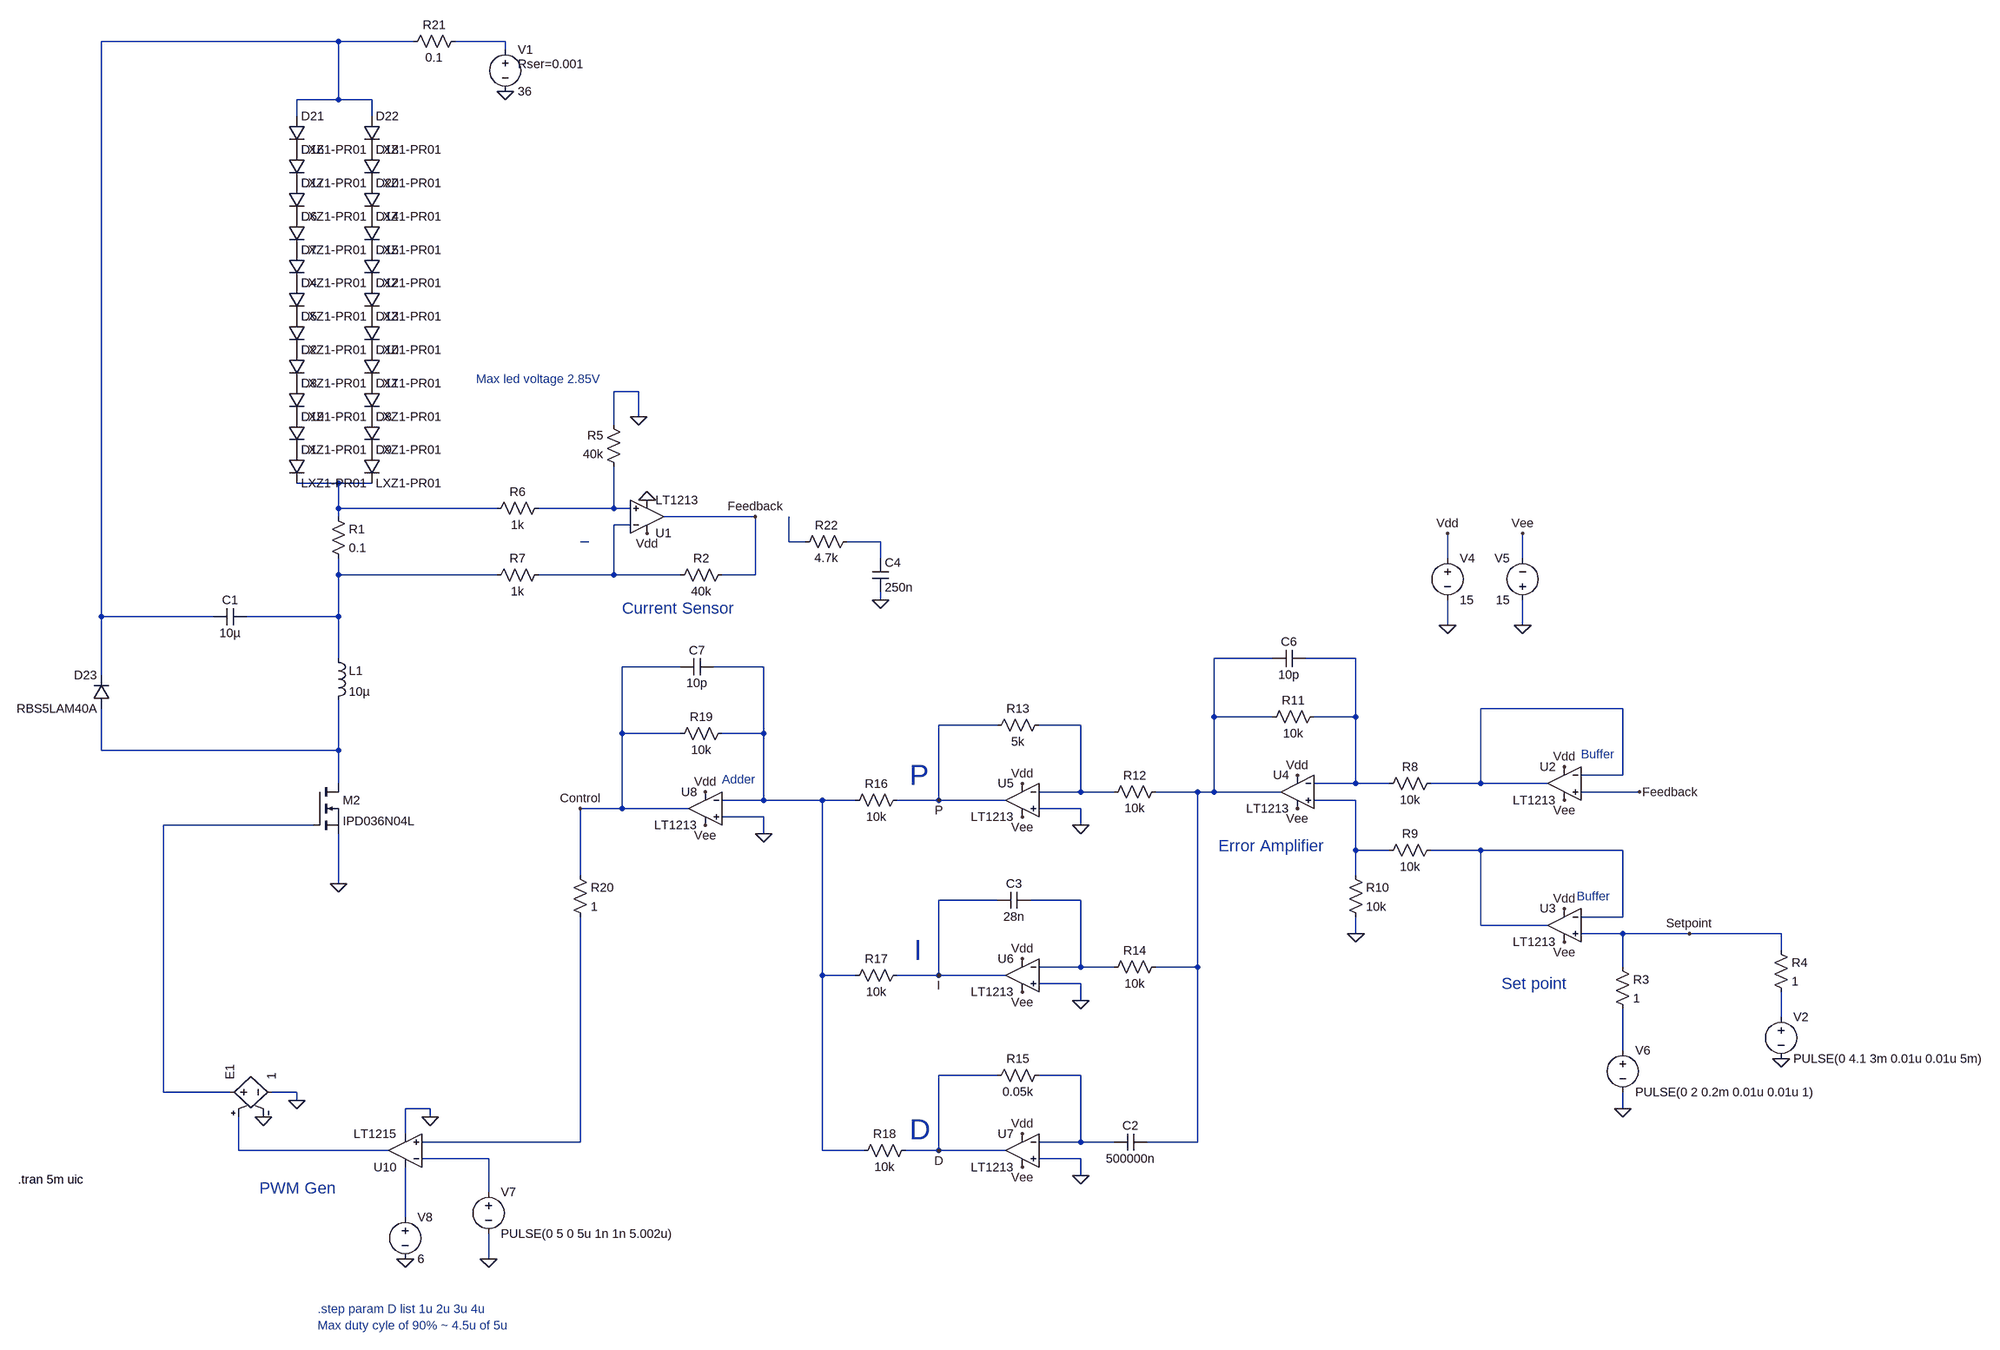
[diagram p0: schematic BuckConvertorTests.asc]
BuckConvertorTests.asc, the LTspice schematic file:
Version 4.1
SHEET 1 3436 2468
WIRE 256 -176 -224 -176
WIRE 400 -176 256 -176
WIRE 576 -176 480 -176
WIRE 576 -160 576 -176
WIRE 256 -64 256 -176
WIRE 256 -64 176 -64
WIRE 320 -64 256 -64
WIRE 176 -32 176 -64
WIRE 320 -32 320 -64
WIRE 832 496 784 496
WIRE 832 544 832 496
WIRE 784 560 784 496
WIRE 256 672 176 672
WIRE 320 672 256 672
WIRE 256 720 256 672
WIRE 560 720 256 720
WIRE 784 720 784 640
WIRE 784 720 640 720
WIRE 816 720 784 720
WIRE 256 736 256 720
WIRE 1056 736 880 736
WIRE 816 752 784 752
WIRE 736 784 720 784
WIRE 1120 784 1120 736
WIRE 1152 784 1120 784
WIRE 1296 784 1232 784
WIRE 1296 816 1296 784
WIRE 2384 816 2384 768
WIRE 2528 816 2528 768
WIRE 256 848 256 816
WIRE 560 848 256 848
WIRE 784 848 784 752
WIRE 784 848 640 848
WIRE 912 848 784 848
WIRE 1056 848 1056 736
WIRE 1056 848 992 848
WIRE 1296 896 1296 880
WIRE -224 928 -224 -176
WIRE 16 928 -224 928
WIRE 256 928 256 848
WIRE 256 928 80 928
WIRE 2384 944 2384 896
WIRE 2528 944 2528 896
WIRE 256 1008 256 928
WIRE 2048 1008 1936 1008
WIRE 2208 1008 2112 1008
WIRE 912 1024 800 1024
WIRE 1072 1024 976 1024
WIRE -224 1040 -224 928
WIRE 2720 1104 2448 1104
WIRE 1936 1120 1936 1008
WIRE 2048 1120 1936 1120
WIRE 2208 1120 2208 1008
WIRE 2208 1120 2128 1120
WIRE 1520 1136 1408 1136
WIRE 1680 1136 1600 1136
WIRE 800 1152 800 1024
WIRE 912 1152 800 1152
WIRE 1072 1152 1072 1024
WIRE 1072 1152 992 1152
WIRE -224 1184 -224 1104
WIRE 256 1184 256 1088
WIRE 256 1184 -224 1184
WIRE 2720 1232 2720 1104
WIRE 2720 1232 2640 1232
WIRE 256 1248 256 1184
WIRE 2208 1248 2208 1120
WIRE 2208 1248 2128 1248
WIRE 2272 1248 2208 1248
WIRE 2448 1248 2448 1104
WIRE 2448 1248 2352 1248
WIRE 2576 1248 2448 1248
WIRE 1680 1264 1680 1136
WIRE 1680 1264 1600 1264
WIRE 1744 1264 1680 1264
WIRE 1904 1264 1824 1264
WIRE 1936 1264 1936 1120
WIRE 1936 1264 1904 1264
WIRE 2064 1264 1936 1264
WIRE 2752 1264 2640 1264
WIRE 1072 1280 1072 1152
WIRE 1072 1280 992 1280
WIRE 1184 1280 1072 1280
WIRE 1248 1280 1184 1280
WIRE 1408 1280 1408 1136
WIRE 1408 1280 1328 1280
WIRE 1536 1280 1408 1280
WIRE 2208 1280 2128 1280
WIRE 800 1296 800 1152
WIRE 800 1296 720 1296
WIRE 928 1296 800 1296
WIRE 1680 1296 1600 1296
WIRE 1072 1312 992 1312
WIRE 208 1328 -80 1328
WIRE 1680 1328 1680 1296
WIRE 1072 1344 1072 1312
WIRE 2208 1376 2208 1280
WIRE 2272 1376 2208 1376
WIRE 2448 1376 2352 1376
WIRE 2720 1376 2448 1376
WIRE 720 1424 720 1296
WIRE 2208 1424 2208 1376
WIRE 256 1440 256 1344
WIRE 1520 1472 1408 1472
WIRE 1680 1472 1584 1472
WIRE 2720 1504 2720 1376
WIRE 2720 1504 2640 1504
WIRE 2448 1520 2448 1376
WIRE 2576 1520 2448 1520
WIRE 2208 1536 2208 1504
WIRE 2720 1536 2640 1536
WIRE 2848 1536 2720 1536
WIRE 3024 1536 2848 1536
WIRE 3024 1568 3024 1536
WIRE 1680 1600 1680 1472
WIRE 1680 1600 1600 1600
WIRE 1744 1600 1680 1600
WIRE 1904 1600 1904 1264
WIRE 1904 1600 1824 1600
WIRE 2720 1600 2720 1536
WIRE 1184 1616 1184 1280
WIRE 1248 1616 1184 1616
WIRE 1408 1616 1408 1472
WIRE 1408 1616 1328 1616
WIRE 1536 1616 1408 1616
WIRE 1680 1632 1600 1632
WIRE 1680 1664 1680 1632
WIRE 3024 1696 3024 1648
WIRE 2720 1760 2720 1680
WIRE 1520 1808 1408 1808
WIRE 1680 1808 1600 1808
WIRE -80 1840 -80 1328
WIRE 48 1840 -80 1840
WIRE 176 1840 128 1840
WIRE 176 1856 176 1840
WIRE 432 1872 384 1872
WIRE 2720 1872 2720 1840
WIRE 432 1888 432 1872
WIRE 384 1920 384 1872
WIRE 720 1936 720 1504
WIRE 720 1936 416 1936
WIRE 1680 1936 1680 1808
WIRE 1680 1936 1600 1936
WIRE 1744 1936 1680 1936
WIRE 1904 1936 1904 1600
WIRE 1904 1936 1808 1936
WIRE 64 1952 64 1888
WIRE 352 1952 64 1952
WIRE 1184 1952 1184 1616
WIRE 1264 1952 1184 1952
WIRE 1408 1952 1408 1808
WIRE 1408 1952 1344 1952
WIRE 1536 1952 1408 1952
WIRE 544 1968 416 1968
WIRE 1680 1968 1600 1968
WIRE 1680 2000 1680 1968
WIRE 544 2032 544 1968
WIRE 384 2080 384 1984
WIRE 544 2160 544 2112
FLAG 256 1440 0
FLAG 2384 944 0
FLAG 2528 944 0
FLAG 2384 768 Vdd
FLAG 2528 768 Vee
FLAG 848 768 Vdd
FLAG 832 544 0
FLAG 2752 1264 Feedback
FLAG 2608 1216 Vdd
FLAG 2608 1488 Vdd
FLAG 2608 1280 Vee
FLAG 2608 1552 Vee
FLAG 2720 1872 0
FLAG 2096 1232 Vdd
FLAG 2096 1296 Vee
FLAG 2208 1536 0
FLAG 1568 1248 Vdd
FLAG 1568 1312 Vee
FLAG 1568 1584 Vdd
FLAG 1568 1648 Vee
FLAG 1568 1920 Vdd
FLAG 1568 1984 Vee
FLAG 1680 1328 0
FLAG 1680 1664 0
FLAG 1680 2000 0
FLAG 960 1264 Vdd
FLAG 960 1328 Vee
FLAG 1072 1344 0
FLAG 720 1296 Control
FLAG 544 2160 0
FLAG 432 1888 0
FLAG 112 1888 0
FLAG 176 1856 0
FLAG 384 2160 0
FLAG 848 704 0
FLAG 1408 1280 P
FLAG 1408 1616 I
FLAG 576 -80 0
FLAG 3024 1776 0
FLAG 2848 1536 Setpoint
FLAG 1408 1952 D
FLAG 1296 896 0
FLAG 1056 736 Feedback
SYMBOL voltage 576 -176 R0
WINDOW 123 0 0 Left 0
WINDOW 39 24 44 Left 2
SYMATTR SpiceLine Rser=0.001
SYMATTR InstName V1
SYMATTR Value 36
SYMBOL diode 160 544 R0
SYMATTR InstName D19
SYMATTR Value LXZ1-PR01
SYMBOL diode 160 608 R0
SYMATTR InstName D1
SYMATTR Value LXZ1-PR01
SYMBOL diode 160 416 R0
SYMATTR InstName D2
SYMATTR Value LXZ1-PR01
SYMBOL diode 160 480 R0
SYMATTR InstName D3
SYMATTR Value LXZ1-PR01
SYMBOL diode 160 288 R0
SYMATTR InstName D4
SYMATTR Value LXZ1-PR01
SYMBOL diode 160 352 R0
SYMATTR InstName D5
SYMATTR Value LXZ1-PR01
SYMBOL diode 160 160 R0
SYMATTR InstName D6
SYMATTR Value LXZ1-PR01
SYMBOL diode 160 224 R0
SYMATTR InstName D7
SYMATTR Value LXZ1-PR01
SYMBOL diode 304 544 R0
SYMATTR InstName D8
SYMATTR Value LXZ1-PR01
SYMBOL diode 304 608 R0
SYMATTR InstName D9
SYMATTR Value LXZ1-PR01
SYMBOL diode 304 416 R0
SYMATTR InstName D10
SYMATTR Value LXZ1-PR01
SYMBOL diode 304 480 R0
SYMATTR InstName D11
SYMATTR Value LXZ1-PR01
SYMBOL diode 304 288 R0
SYMATTR InstName D12
SYMATTR Value LXZ1-PR01
SYMBOL diode 304 352 R0
SYMATTR InstName D13
SYMATTR Value LXZ1-PR01
SYMBOL diode 304 160 R0
SYMATTR InstName D14
SYMATTR Value LXZ1-PR01
SYMBOL diode 304 224 R0
SYMATTR InstName D15
SYMATTR Value LXZ1-PR01
SYMBOL diode 160 32 R0
SYMATTR InstName D16
SYMATTR Value LXZ1-PR01
SYMBOL diode 160 96 R0
SYMATTR InstName D17
SYMATTR Value LXZ1-PR01
SYMBOL diode 304 32 R0
SYMATTR InstName D18
SYMATTR Value LXZ1-PR01
SYMBOL diode 304 96 R0
SYMATTR InstName D20
SYMATTR Value LXZ1-PR01
SYMBOL diode 160 -32 R0
SYMATTR InstName D21
SYMATTR Value LXZ1-PR01
SYMBOL diode 304 -32 R0
SYMATTR InstName D22
SYMATTR Value LXZ1-PR01
SYMBOL res 240 720 R0
SYMATTR InstName R1
SYMATTR Value 0.1
SYMBOL nmos 208 1248 R0
SYMATTR InstName M2
SYMATTR Value IPD036N04L
SYMBOL cap 16 944 R270
WINDOW 0 32 32 VTop 2
WINDOW 3 0 32 VBottom 2
SYMATTR InstName C1
SYMATTR Value 10µ
SYMBOL diode -208 1104 R180
WINDOW 0 24 64 Left 2
WINDOW 3 24 0 Left 2
SYMATTR InstName D23
SYMATTR Value RBS5LAM40A
SYMBOL ind 240 992 R0
SYMATTR InstName L1
SYMATTR Value 10µ
SYMATTR SpiceLine Rser=1m
SYMBOL OpAmps\\LT1213 848 800 M180
SYMATTR InstName U1
SYMBOL voltage 2384 800 R0
WINDOW 123 0 0 Left 0
WINDOW 39 0 0 Left 0
SYMATTR InstName V4
SYMATTR Value 15
SYMBOL voltage 2528 912 R180
WINDOW 0 24 96 Left 2
WINDOW 3 24 16 Left 2
WINDOW 123 0 0 Left 0
WINDOW 39 0 0 Left 0
SYMATTR InstName V5
SYMATTR Value 15
SYMBOL res 1008 832 R90
WINDOW 0 0 56 VBottom 2
WINDOW 3 32 56 VTop 2
SYMATTR InstName R2
SYMATTR Value 40k
SYMBOL res 800 656 R180
WINDOW 0 36 76 Left 2
WINDOW 3 36 40 Left 2
SYMATTR InstName R5
SYMATTR Value 40k
SYMBOL res 656 704 R90
WINDOW 0 0 56 VBottom 2
WINDOW 3 32 56 VTop 2
SYMATTR InstName R6
SYMATTR Value 1k
SYMBOL res 656 832 R90
WINDOW 0 0 56 VBottom 2
WINDOW 3 32 56 VTop 2
SYMATTR InstName R7
SYMATTR Value 1k
SYMBOL OpAmps\\LT1213 2608 1184 M0
SYMATTR InstName U2
SYMBOL voltage 2720 1744 R0
WINDOW 123 0 0 Left 0
WINDOW 39 0 0 Left 0
SYMATTR InstName V6
SYMATTR Value PULSE(0 2 0.2m 0.01u 0.01u 1)
SYMBOL res 2368 1232 R90
WINDOW 0 0 56 VBottom 2
WINDOW 3 32 56 VTop 2
SYMATTR InstName R8
SYMATTR Value 10k
SYMBOL res 2368 1360 R90
WINDOW 0 0 56 VBottom 2
WINDOW 3 32 56 VTop 2
SYMATTR InstName R9
SYMATTR Value 10k
SYMBOL res 2192 1408 R0
SYMATTR InstName R10
SYMATTR Value 10k
SYMBOL res 2144 1104 R90
WINDOW 0 0 56 VBottom 2
WINDOW 3 32 56 VTop 2
SYMATTR InstName R11
SYMATTR Value 10k
SYMBOL res 1840 1248 R90
WINDOW 0 0 56 VBottom 2
WINDOW 3 32 56 VTop 2
SYMATTR InstName R12
SYMATTR Value 10k
SYMBOL res 1616 1120 R90
WINDOW 0 0 56 VBottom 2
WINDOW 3 32 56 VTop 2
SYMATTR InstName R13
SYMATTR Value 5k
SYMBOL res 1840 1584 R90
WINDOW 0 0 56 VBottom 2
WINDOW 3 32 56 VTop 2
SYMATTR InstName R14
SYMATTR Value 10k
SYMBOL res 1616 1792 R90
WINDOW 0 0 56 VBottom 2
WINDOW 3 32 56 VTop 2
SYMATTR InstName R15
SYMATTR Value 0.05k
SYMBOL cap 1808 1920 R90
WINDOW 0 0 32 VBottom 2
WINDOW 3 32 32 VTop 2
SYMATTR InstName C2
SYMATTR Value 500000n
SYMBOL cap 1584 1456 R90
WINDOW 0 0 32 VBottom 2
WINDOW 3 32 32 VTop 2
SYMATTR InstName C3
SYMATTR Value 28n
SYMBOL res 1344 1264 R90
WINDOW 0 0 56 VBottom 2
WINDOW 3 32 56 VTop 2
SYMATTR InstName R16
SYMATTR Value 10k
SYMBOL res 1344 1600 R90
WINDOW 0 0 56 VBottom 2
WINDOW 3 32 56 VTop 2
SYMATTR InstName R17
SYMATTR Value 10k
SYMBOL res 1360 1936 R90
WINDOW 0 0 56 VBottom 2
WINDOW 3 32 56 VTop 2
SYMATTR InstName R18
SYMATTR Value 10k
SYMBOL res 1008 1136 R90
WINDOW 0 0 56 VBottom 2
WINDOW 3 32 56 VTop 2
SYMATTR InstName R19
SYMATTR Value 10k
SYMBOL OpAmps\\LT1213 2608 1456 M0
SYMATTR InstName U3
SYMBOL OpAmps\\LT1213 2096 1200 M0
SYMATTR InstName U4
SYMBOL OpAmps\\LT1213 1568 1216 M0
SYMATTR InstName U5
SYMBOL OpAmps\\LT1213 1568 1552 M0
SYMATTR InstName U6
SYMBOL OpAmps\\LT1213 1568 1888 M0
SYMATTR InstName U7
SYMBOL OpAmps\\LT1213 960 1232 M0
SYMATTR InstName U8
SYMBOL voltage 544 2016 R0
WINDOW 123 0 0 Left 0
WINDOW 39 0 0 Left 0
SYMATTR InstName V7
SYMATTR Value PULSE(0 5 0 5u 1n 1n 5.002u)
SYMBOL res 704 1408 R0
SYMATTR InstName R20
SYMATTR Value 1
SYMBOL e 32 1840 R270
SYMATTR InstName E1
SYMATTR Value 1
SYMBOL OpAmps\\LT1215 384 2016 R180
SYMATTR InstName U10
SYMBOL voltage 384 2064 R0
WINDOW 123 0 0 Left 0
WINDOW 39 0 0 Left 0
SYMATTR InstName V8
SYMATTR Value 6
SYMBOL voltage 3024 1680 R0
WINDOW 123 0 0 Left 0
WINDOW 39 0 0 Left 0
SYMATTR InstName V2
SYMATTR Value PULSE(0 4.1 3m 0.01u 0.01u 5m)
SYMBOL res 2704 1584 R0
SYMATTR InstName R3
SYMATTR Value 1
SYMBOL res 3008 1552 R0
SYMATTR InstName R4
SYMATTR Value 1
SYMBOL res 496 -192 R90
WINDOW 0 0 56 VBottom 2
WINDOW 3 32 56 VTop 2
SYMATTR InstName R21
SYMATTR Value 0.1
SYMBOL cap 1280 816 R0
SYMATTR InstName C4
SYMATTR Value 250n
SYMBOL res 1248 768 R90
WINDOW 0 0 56 VBottom 2
WINDOW 3 32 56 VTop 2
SYMATTR InstName R22
SYMATTR Value 4.7k
SYMBOL cap 2112 992 R90
WINDOW 0 0 32 VBottom 2
WINDOW 3 32 32 VTop 2
SYMATTR InstName C6
SYMATTR Value 10p
SYMBOL cap 976 1008 R90
WINDOW 0 0 32 VBottom 2
WINDOW 3 32 32 VTop 2
SYMATTR InstName C7
SYMATTR Value 10p
TEXT -384 2008 Left 2 !.tran 5m uic
TEXT 520 472 Left 2 ;Max led voltage 2.85V
TEXT 216 2256 Left 2 ;.step param D list 1u 2u 3u 4u
TEXT 216 2288 Left 2 ;Max duty cyle of 90% ~ 4.5u of 5u
TEXT 1944 1368 Left 3 ;Error Amplifier
TEXT 1352 1232 Left 5 ;P
TEXT 1360 1568 Left 5 ;I
TEXT 1352 1912 Left 5 ;D
TEXT 2488 1632 Left 3 ;Set point
TEXT 2640 1192 Left 2 ;Buffer
TEXT 2632 1464 Left 2 ;Buffer
TEXT 104 2024 Left 3 ;PWM Gen
TEXT 992 1240 Left 2 ;Adder
TEXT 800 912 Left 3 ;Current Sensor

The netlist it stands for:
* BuckConvertorTests.asc
V1 N002 0 36 Rser=0.001
D19 P001 P002 LXZ1-PR01
D1 P002 N003 LXZ1-PR01
D2 P003 P004 LXZ1-PR01
D3 P004 P001 LXZ1-PR01
D4 P005 P006 LXZ1-PR01
D5 P006 P003 LXZ1-PR01
D6 P007 P008 LXZ1-PR01
D7 P008 P005 LXZ1-PR01
D8 P009 P010 LXZ1-PR01
D9 P010 N003 LXZ1-PR01
D10 P011 P012 LXZ1-PR01
D11 P012 P009 LXZ1-PR01
D12 P013 P014 LXZ1-PR01
D13 P014 P011 LXZ1-PR01
D14 P015 P016 LXZ1-PR01
D15 P016 P013 LXZ1-PR01
D16 P017 P018 LXZ1-PR01
D17 P018 P007 LXZ1-PR01
D18 P019 P020 LXZ1-PR01
D20 P020 P015 LXZ1-PR01
D21 N001 P017 LXZ1-PR01
D22 N001 P019 LXZ1-PR01
R1 N003 N009 0.1
M2 N015 N017 0 0 IPD036N04L
C1 N001 N009 10µ
D23 N015 N001 RBS5LAM40A
L1 N009 N015 10µ Rser=1m
X§U1 N004 N005 Vdd 0 Feedback LT1213  ; pins In+ In- V+ V- OUT
V4 Vdd 0 15
V5 0 Vee 15
R2 Feedback N005 40k
R5 N004 0 40k
R6 N004 N003 1k
R7 N005 N009 1k
X§U2 Feedback N013 Vdd Vee N013 LT1213  ; pins In+ In- V+ V- OUT
V6 N021 0 PULSE(0 2 0.2m 0.01u 0.01u 1)
R8 N013 N011 10k
R9 N018 N016 10k
R10 N016 0 10k
R11 N011 N010 10k
R12 N010 N014 10k
R13 N014 P 5k
R14 N010 N019 10k
R15 N022 D 0.05k
C2 N010 N022 500000n
C3 N019 I 28n
R16 P N012 10k
R17 I N012 10k
R18 D N012 10k
R19 N012 Control 10k
X§U3 Setpoint N018 Vdd Vee N018 LT1213  ; pins In+ In- V+ V- OUT
X§U4 N016 N011 Vdd Vee N010 LT1213  ; pins In+ In- V+ V- OUT
X§U5 0 N014 Vdd Vee P LT1213  ; pins In+ In- V+ V- OUT
X§U6 0 N019 Vdd Vee I LT1213  ; pins In+ In- V+ V- OUT
X§U7 0 N022 Vdd Vee D LT1213  ; pins In+ In- V+ V- OUT
X§U8 0 N012 Vdd Vee Control LT1213  ; pins In+ In- V+ V- OUT
V7 N025 0 PULSE(0 5 0 5u 1n 1n 5.002u)
R20 Control N023 1
E1 N017 0 N024 0 1
X§U10 N023 N025 N026 0 N024 LT1215  ; pins In+ In- V+ V- OUT
V8 N026 0 6
V2 N020 0 PULSE(0 4.1 3m 0.01u 0.01u 5m)
R3 Setpoint N021 1
R4 Setpoint N020 1
R21 N002 N001 0.1
C4 N008 0 250n
R22 N008 N007 4.7k
C6 N011 N010 10p
C7 N012 Control 10p
.model D D
.lib standard.dio
.model NMOS NMOS
.model PMOS PMOS
.lib standard.mos
.tran 5m uic
* Max led voltage 2.85V
* .step param D list 1u 2u 3u 4u
* Max duty cyle of 90% ~ 4.5u of 5u
* Error Amplifier
* P
* I
* D
* Set point
* Buffer
* Buffer
* PWM Gen
* Adder
* Current Sensor
.lib LTC.lib
.backanno
.end